# Altium schematic sheet MercurialSDR_MISC.SchDoc: p2020 v1
size A4; Author: RF-Lab; DrawnBy: RF-Lab; Revision: Rev1.0; SheetNumber: 6; SheetTotal: 6; ProjectName: MercurialSDR
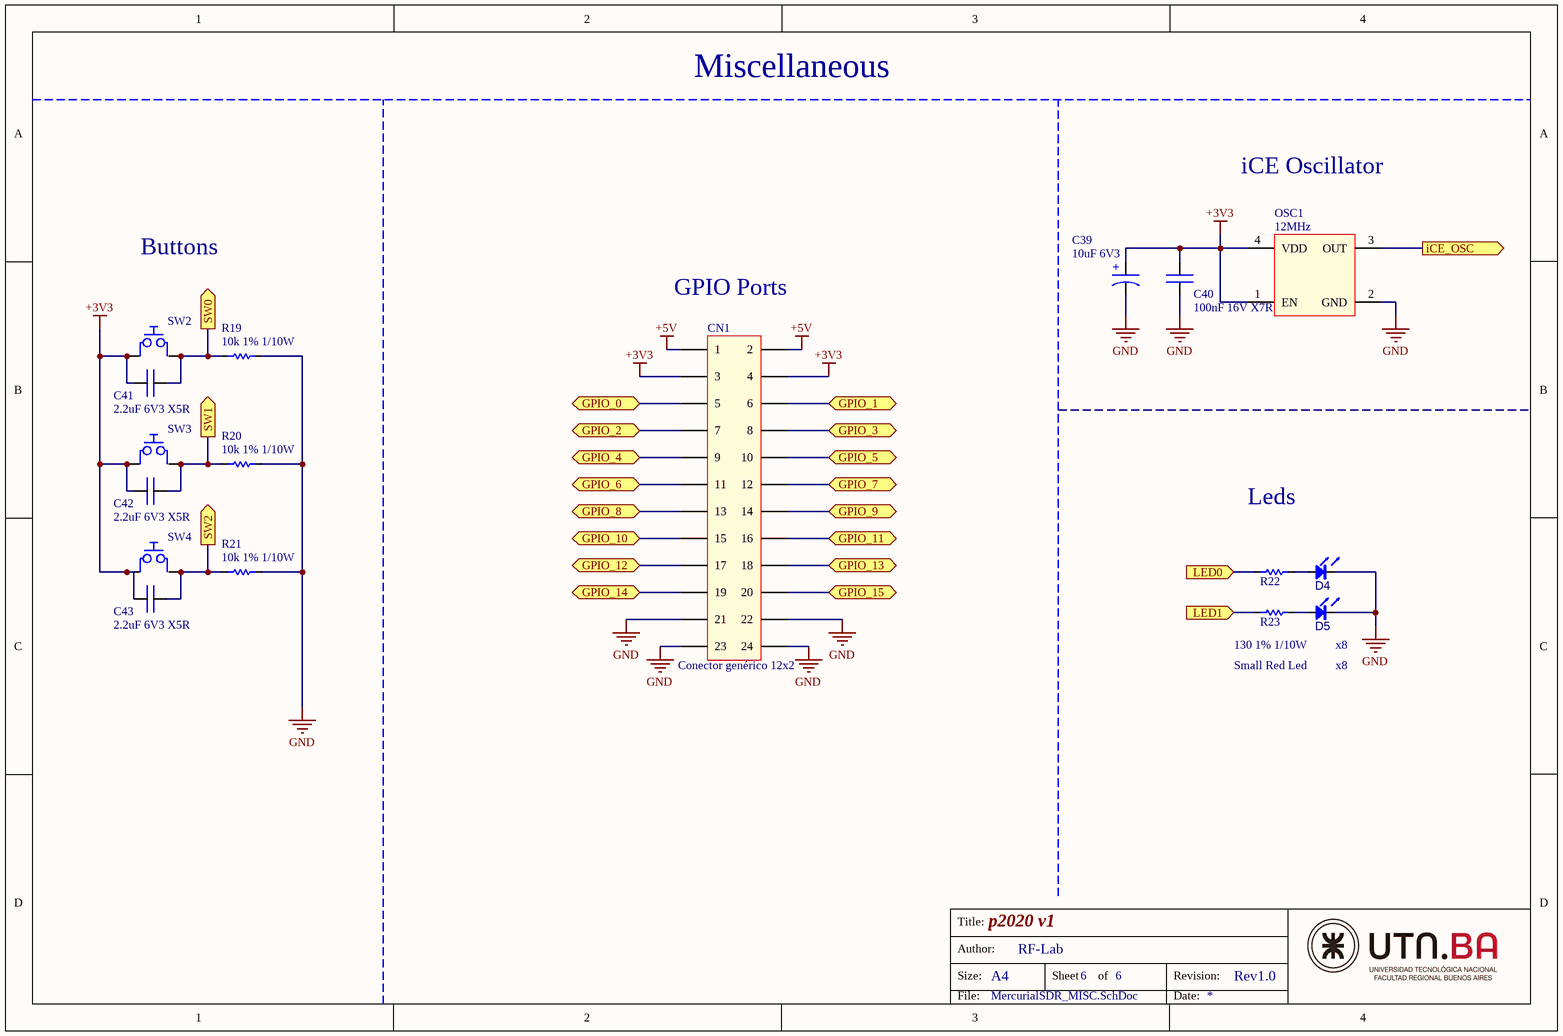
[diagram p0: MercurialSDR_MISC.SchDoc]

## Parts
C39  value 10uF 6V3  [CAP_TANT_1206]  (hidden comment: 10uF 6V3 - TAJA106K006RNJ)
C40  value 100nF 16V X7R  [CAP_0603]  (hidden comment: 100nF 16V X7R - CL10B104KO8NNNC)
C41  value 2.2uF 6V3 X5R  [CAP_0603]  (hidden comment: 2.2uF 6V3 X5R - CL10A225KQ8NNNC)
C42  value 2.2uF 6V3 X5R  [CAP_0603]  (hidden comment: 2.2uF 6V3 X5R - CL10A225KQ8NNNC)
C43  value 2.2uF 6V3 X5R  [CAP_0603]  (hidden comment: 2.2uF 6V3 X5R - CL10A225KQ8NNNC)
CN1  value Conector genérico 12x2  [CON_12x2]  (hidden comment: 6-534236-2 // PPPC122LFBN)
D4  LTST-C190KRKT  [LED_0603]  (value not drawn)
D5  Color: Small Red Led  [LED_0603]  (hidden comment: LTST-C190KRKT)
OSC1  Frequency: 12MHz  [VFLGA_2.5x2.0]  (hidden comment: DSC6003JI2A-012.0000T)
R19  value 10k 1% 1/10W  [RES_0603]  (hidden comment: 10k 1% 1/10W - CR0603-FX-1002EAS)
R20  value 10k 1% 1/10W  [RES_0603]  (hidden comment: 10k 1% 1/10W - CR0603-FX-1002EAS)
R21  value 10k 1% 1/10W  [RES_0603]  (hidden comment: 10k 1% 1/10W - CR0603-FX-1002EAS)
R22  130 1% 1/10W - CR0603-FX-1300ELF  [RES_0603]  (value not drawn)
R23  value 130 1% 1/10W  [RES_0603]  (hidden comment: 130 1% 1/10W - CR0603-FX-1300ELF)
SW2  PTS645SM43SMTR92 LFS  [SWITCH_6X6mm]  (value not drawn)
SW3  PTS645SM43SMTR92 LFS  [SWITCH_6X6mm]  (value not drawn)
SW4  PTS645SM43SMTR92 LFS  [SWITCH_6X6mm]  (value not drawn)

## Ports
GPIO_0 (bidir), GPIO_1 (bidir), GPIO_2 (bidir), GPIO_3 (bidir), GPIO_4 (bidir), GPIO_5 (bidir), GPIO_6 (bidir), GPIO_7 (bidir), GPIO_8 (bidir), GPIO_9 (bidir), GPIO_10 (bidir), GPIO_11 (bidir), GPIO_12 (bidir), GPIO_13 (bidir), GPIO_14 (bidir), GPIO_15 (bidir), iCE_OSC (out), LED0 (in), LED1 (in), SW0 (out), SW1 (out), SW2 (out)

## Nets
+3V3: C39.1 C40.1 C41.1 C42.1 C43.1 CN1.3 CN1.4 OSC1.1(EN) OSC1.4(VDD) SW2.1 SW3.1 SW4.1
+5V: CN1.1 CN1.2
GND: C39.2 C40.2 CN1.21 CN1.22 CN1.23 CN1.24 D4.2(K) D5.2(K) OSC1.2(GND) R19.1 R20.1 R21.1
GPIO_0: CN1.5 ; port GPIO_0
GPIO_1: CN1.6 ; port GPIO_1
GPIO_2: CN1.7 ; port GPIO_2
GPIO_3: CN1.8 ; port GPIO_3
GPIO_4: CN1.9 ; port GPIO_4
GPIO_5: CN1.10 ; port GPIO_5
GPIO_6: CN1.11 ; port GPIO_6
GPIO_7: CN1.12 ; port GPIO_7
GPIO_8: CN1.13 ; port GPIO_8
GPIO_9: CN1.14 ; port GPIO_9
GPIO_10: CN1.15 ; port GPIO_10
GPIO_11: CN1.16 ; port GPIO_11
GPIO_12: CN1.17 ; port GPIO_12
GPIO_13: CN1.18 ; port GPIO_13
GPIO_14: CN1.19 ; port GPIO_14
GPIO_15: CN1.20 ; port GPIO_15
iCE_OSC: OSC1.3(OUT) ; port iCE_OSC
LED0: R22.2 ; port LED0
LED1: R23.2 ; port LED1
SW0: C41.2 R19.2 SW2.4 ; port SW0
SW1: C42.2 R20.2 SW3.4 ; port SW1
SW2: C43.2 R21.2 SW4.4 ; port SW2
NetD4_1: D4.1(A) R22.1
NetD5_1: D5.1(A) R23.1

Not connected (* = marked no-connect by the designer): SW2 2 3; SW3 2 3; SW4 2 3

## Notes on the sheet
- Miscellaneous
- iCE Oscillator
- Buttons
- (near CN1) GPIO Ports
- Leds
- x8
- Title:
- Size:
- Author:
- A4
- Sheet
- of
- Revision:
- File:
- Date:
- (in symbol Cap Pol) +

## Library data of the parts
C39 = Cap Pol: Capacitor polarizado
C40 C42 C43 = Cap: Capacitor no polarizado; Material: Ceramic
  C40: Temp Coef: X7R; Part Number: CL10B104KO8NNNC; VR: 16V
  C42 C43: Temp Coef: X5R; Part Number: CL10A225KQ8NNNC; VR: 6V3
C41 = Cap: Capacitor no polarizado
CN1 = CN_12x2: Conector genérico 12x2; Part Number: 6-534236-2
D4 = Led_small: Color: Red; Part Number: LTST-C190KRKT
D5 = Led_small: Part Number: LTST-C190KRKT
OSC1 = Oscillator: Oscilador de 4 terminales; Part Number: DSC6003JI2A-012.0000T
R19-R21 R23 = Res: Resistor
  R23: Power: 1/10W; Part Number: CR0603-FX-1300ELF; Tolerance: 1%
R22 = Res: Resistor; Value: 130; Power: 1/10W; Part Number: CR0603-FX-1300ELF; Tolerance: 1%
SW2-SW4 = Pulsador: Part Number: PTS645SM43SMTR92 LFS